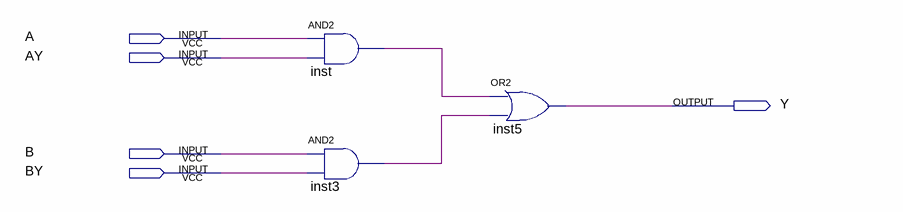
[diagram p0: schematic sheet]
// Quartus schematic x1_2_1.bdf as structural Verilog: 3 symbols, 5 pins
module x1_2_1 (
  input  A,
  input  AY,
  input  B,
  input  BY,
  output Y
);

  wire inst3_out, inst_out;

  and inst (inst_out, A, AY);
  and inst3 (inst3_out, B, BY);
  or inst5 (Y, inst_out, inst3_out);
endmodule
